# Altium schematic sheet MCU.SchDoc: LUNA_MCU
size A; Date: 13.07.2025; Author: Mert Ali Cakici; Revision: 0.1; SheetNumber: 1; SheetTotal: 3
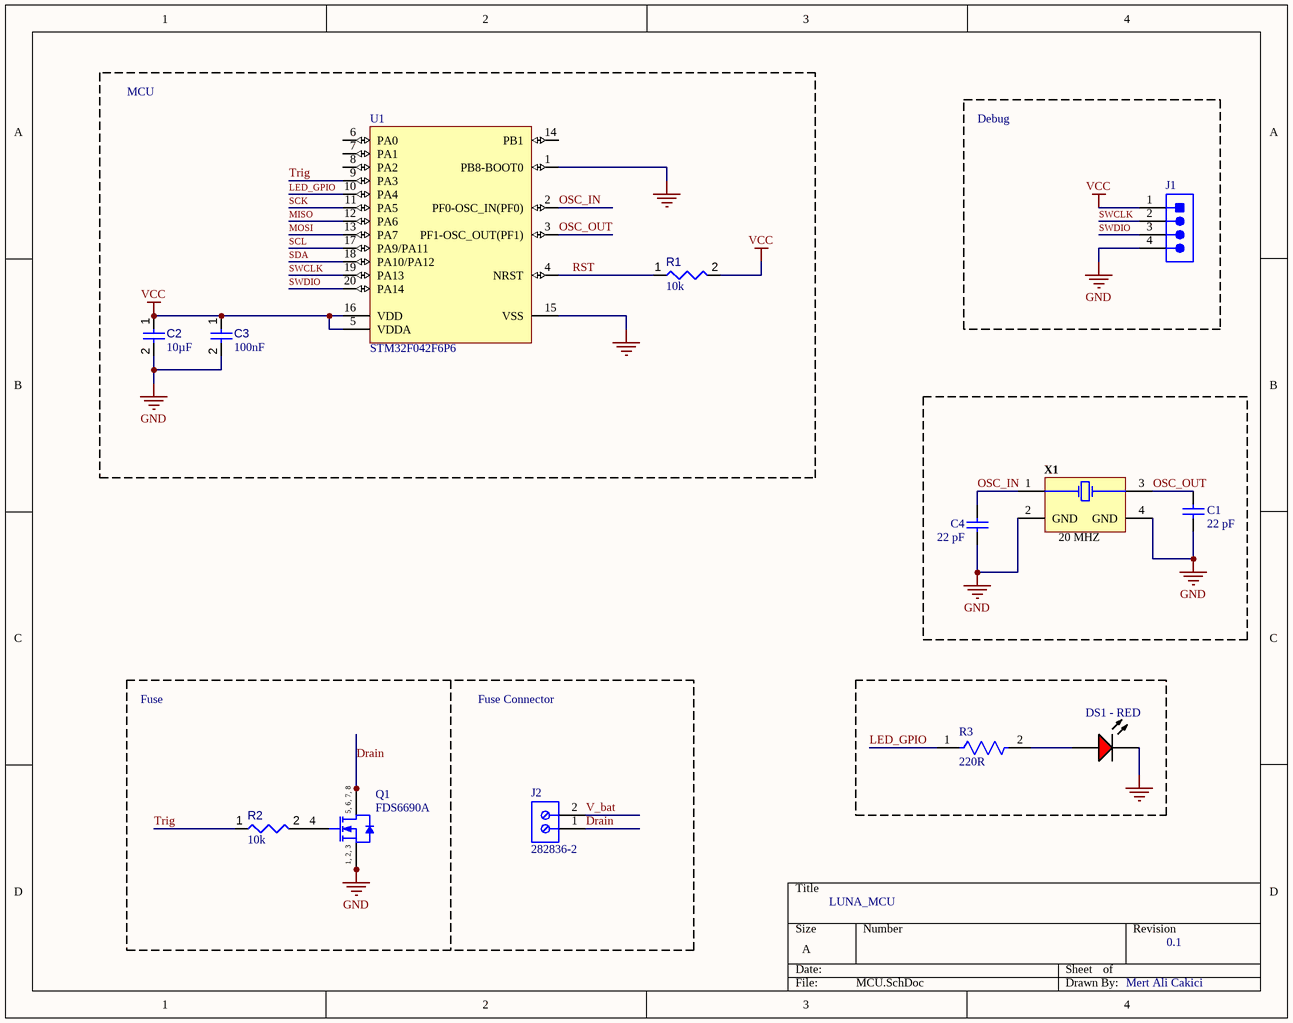
[diagram p0: MCU.SchDoc]

## Parts
C1  22 pF  [CAPC1608X90X35NL10T15]
C2  value 10µF  [CAPC0603(1608)100_L]  (hidden comment: Capacitor 10µF +/-20% 10V 0603)
C3  value 100nF  [CAPC1608X90X40NL10T20]  (hidden comment: Capacitor 100 nF +/-10% 50 V 0603)
C4  22 pF  [CAPC1608X90X35NL10T15]
DS1_-_RED  19-217/R6C-AL1M2VY/3T  [EVRL-0603-2_V]  (value not drawn)
J1  640456-4  [TECO-640456-4]  (value not drawn)
J2  282836-2  [TECO-282836-2_V]
Q1  FDS6690A  [FAIR-SOIC-8_V]
R1  value 10k  [RESC1608X55X25NL10T15]  (hidden comment: Resistor 10k +/-1% 0603 100 mW)
R2  value 10k  [RESC1608X55X25NL10T15]  (hidden comment: Resistor 10k +/-1% 0603 100 mW)
R3  220R  [FP-CRCW0603-e3-MFG]
U1  STM32F042F6P6  [STM-TSSOP20_M]
X1  20 MHZ  [TXC-7B-4_V]

## Blocks framed on the sheet
MCU: C2 C3 R1 U1
Debug: J1

## Nets
GND: C1.1 C2.2 C3.2 C4.1 DS1_-_RED.2(K) J1.4 Q1.1(S) Q1.2(S) Q1.3(S) U1.1(PB8-BOOT0) U1.15(VSS) X1.2(GND) X1.4(GND)
VCC: C2.1 C3.1 J1.1 R1.2 U1.5(VDDA) U1.16(VDD)
Drain: J2.1 Q1.5(D) Q1.6(D) Q1.7(D) Q1.8(D)
LED_GPIO: R3.1 U1.10(PA4)
MISO: U1.12(PA6)
MOSI: U1.13(PA7)
OSC_IN: C4.2 U1.2(PF0-OSC_IN(PF0)) X1.1(X1)
OSC_OUT: C1.2 U1.3(PF1-OSC_OUT(PF1)) X1.3(X2)
RST: R1.1 U1.4(NRST)
SCK: U1.11(PA5)
SCL: U1.17(PA9/PA11)
SDA: U1.18(PA10/PA12)
SWCLK: J1.2 U1.19(PA13)
SWDIO: J1.3 U1.20(PA14)
Trig: R2.1 U1.9(PA3)
V_bat: J2.2
NetDS1_-_RED_1: DS1_-_RED.1(A) R3.2
NetQ1_4: Q1.4(G) R2.2

Not connected (* = marked no-connect by the designer): U1 6(PA0) 7(PA1) 8(PA2) 14(PB1)

## Notes on the sheet
- Fuse
- Fuse Connector
- (in symbol CMP-2000-06260-1) 5, 6, 7, 8; 1, 2, 3

## Library data of the parts
C1 C4 = CMP-2000-04945-1: Chip Capacitor, 22 pF, +/- 5%, 50 V, -55 to 125 degC, 0603 (1608 Metric), RoHS, Tape and Reel; Manufacturer: Murata; Capacitance: 22pF; Rated Voltage: 50V; Dielectric: C0G; Manufacturer URL: http://www.murata.com/; Datasheet Version: Jul-06; Package Reference: 603; Tolerance (%): ±5%; Case Size/Dimension: 0603; Package Description: 2-Pin Surface Mount Device, Body 1.6 x 0.8 mm; Datasheet URL: https://datasheet.ciiva.com/11786/0900766b807a1cab-11786398.pdf
C2 = CMP-001-00075-4: Chip Capacitor, 10µF +/-20%, 10V, 0603, Thickness 1 mm; Tolerance: 10%; Voltage Rating: 10V; Max Operating Temperature: 85°C; Pins: 2; Case/Package: 0603; Mounting Technology: SMT; Min Operating Temperature: -55°C
C3 = CMP-001-00017-6: Chip Capacitor, 100 nF, +/- 10%, 50 V, 0603 (1608 Metric); Voltage Rating: 50V; Capacitor Type: Ceramic; Tolerance: 10%; Mounting Technology: SM; Max Operating Temperature: 125°C; RoHS Compliant: True; Pins: 2; Case/Package: 0603; Min Operating Temperature: -55°C
DS1_-_RED = CMP-007-00004-2: Chip LED, Red, 5 V, 25 mA, -40 to 85 degC, 2-Pin SMD (0603), RoHS, Tape and Reel; Manufacturer: Everlight Electronics; Forward Voltage: 2.2V; Lens Style: Clear; Package Reference: 0603; Datasheet Version: Rev. 1, 01/2005; Mounting Technology: SM; RoHS Compliant: False; Datasheet URL: https://datasheet.ciiva.com/4688/el-19-217-r6c-al1m2vy-3tpdf-187026-4688713.pdf; Case/Package: 0603; Colour: Red; Manufacturer URL: http://www.everlight.com/; Package Description: 2-Pin Surface Mount Device, Body 1.6 x 0.8 mm
J1 = CMP-2000-05419-1: Male Header, Pitch 2.54 mm, 1 x 4 Position, Height 10.03 mm, Tail Length 3.56 mm, RoHS, Bulk; Manufacturer: TE Connectivity; Material, Housing: Polyester; Primary Type: InterconnectSystem; Mount Angle: Vertical; Color, Housing: White; Current, Rating: 5 / A; Agency Approvals: CSA,UL; Contact Termination Area Plating: Tin; Temperature, Operating: -55to+105 / degC; Standards: RoHSCompliant,ELVCompliant,UL94V-0; Number of Positions: 4; Brand/Series: MTA-100Series; Angle: Straight; Pin Spacing: 0.1 / "; Material, Contact: CopperAlloy; Connector Type: MTA-100; Special Features: Pinstrip; Mounting Hole Size: 0.04 / "; Contact Centerline Spacing: 0.100 / in.; Voltage, Rating: 250 / V; Manufacturer URL: http://www.te.com/; Length, Pin: 0.14 / "; Length, Overall: 0.4 / "; Color: White; Flammability Rating: UL94V-0; Mounting Type: PCMount; Termination: Solder; Datasheet URL: https://datasheet.ciiva.com/16286/eng-ds-82056-mta-0608-16286228.pdf; Number of Contacts: 4; Contact Shape: Square; Contact Mating Area Plating: Tin; Length, Terminal Post: 0.14 / in.; Size, Post: 0.025 / in.; Contact Plating: Tin; Type: PCBPlug; Datasheet Version: Dec-14; Number of Rows: 1
J2 = CMP-1684-00017-1: Female Header, Pitch 5 mm, 1 x 2 Position, Height 10 mm, Tail Length 3.5 mm, Rohs, Bulk; Manufacturer: TE Connectivity; Wire Gauge: 16-30AWG; Product Training Modules: Wire-to-BoardEurostyleTerminalBlocks; Clamp Material - Plating: Brass-NickelPlated; Voltage: 300V; Mating Orientation: HorizontalwithBoard; Current: 13.5A; Pitch: 0.197"(5.00mm); Screw Thread: M3; 3D Model: 282836-2.pdf; Other Names: 5ULV-02B / A98076; Dynamic Catalog: BuchananSeries; Number of Levels: 1; Torque - Screw: 0.68Nm(6Lb-In); Featured Product: EurostyleTerminalBlockConnectors; Positions Per Level: 2; Wire Termination: Screw-RisingCageClamp; Datasheet URL: http://www.te.com.cn/commerce/DocumentDelivery/DDEController?Action=showdoc&DocId=Catalog+Section%7F1308389_EUROSTYLE_TERMINAL_BLOCKS%7F0607%7Fpdf%7FEnglish%7FENG_CS_1308389_EUROSTYLE_TERMINAL_BLOCKS_0607.pdf%7F282836-2; Color: Green; Family: TerminalBlocks-WiretoBoard; RoHS Information: 282836-2StatementofCompliance; Standard Package: 300; Contact Material - Plating: Brass-TinPlated; Manufacturer URL: http://www.te.com; Housing Material: Polyamide(PA66),Nylon6/6; Features: Interlocking(Side); Package Description: Female Header, Pitch 5 mm, 1 x 2 Position, Height 10 mm, Tail Length 3.5 mm; Mounting Type: ThroughHole; Package Reference: THD; Packaging: Bulk; Series: Buchanan; Category: Connectors,Interconnects; Screw Material - Plating: Brass-NickelPlated
Q1 = CMP-2000-06260-1: Single N-Channel, Logic-Level, PowerTrench(R) MOSFET, 11 A, 30 V, -55 to 150 degC, 8-Pin SOIC (SO-8), RoHS, Tape and Reel; Manufacturer: Fairchild Semiconductor; Typical Turn-Off Delay Time: 28ns; Transistor Material: Si; Typical Turn-On Delay Time: 9ns; Channel Mode: Enhancement; Maximum Power Dissipation: 2.5W; Typical Input Capacitance @ Vds: 1205pF@15V; Maximum Continuous Drain Current: 11A; Maximum Gate Source Voltage: ±20V; Channel Type: N; Typical Gate Charge @ Vgs: 12nC@5V; Number of Elements per Chip: 1; Minimum Gate Threshold Voltage: 1V; Maximum Drain Source Resistance: 0.013Ω; Maximum Drain Source Voltage: 30V; Datasheet Version: Rev. E1, 02/2007; Length: 5mm; Category: PowerMOSFET; Mounting Type: SurfaceMount; Pin Count: 8; Minimum Operating Temperature: -55°C; Dimensions: 5x4x1.5mm; Package Type: SOIC; Width: 4mm; Datasheet URL: https://www.fairchildsemi.com/datasheets/FD/FDS6690A.pdf; Manufacturer URL: https://www.fairchildsemi.com/; Package URL: https://www.fairchildsemi.com/package-drawings/M0/M08A.pdf; Mounting Technology: SurfaceMount; Package Reference: SOIC-8; Maximum Operating Temperature: +150°C; Package Description: 8-Pin Small Outline Integrated Circuit, Body 4.9 x 3.9 mm, Pitch 1.27 mm; Transistor Configuration: Single; Height: 1.5mm
R1 R2 = CMP-009-00017-5: Chip Resistor, 10 KOhm, +/- 1%, 01 W, -55 to 155 degC, 0603 (1608 Metric); Voltage Rating: 50V; Power: 100mW; RoHS Compliant: True; Min Operating Temperature: -55°C; Pins: 2; Case/Package: 0603; Mounting Technology: SM; Max Operating Temperature: 155°C; Tolerance: 1%
R3 = CMP-2000-03085-2: RES Thick Film, 220Ω, 1%, 0.1W, 100ppm/°C, 0603; Power Rating: 100mW; Voltage Rating: 75V; Contact Plating: Tin; Package Quantity: 10; Lead Free: Lead Free; Packaging: Tape and Reel; Max Operating Temperature: 155°C; Case/Package: 0603; Radiation Hardening: No; Height: 0.45mm; Width: 0.033inch; Case Code (Imperial): 0603; Number of Terminations: 2; Tolerance: 1%; Min Operating Temperature: -55°C; Termination: SMD/SMT; Length: 1.55mm; Features: Automotive AEC-Q200; Voltage Rating (DC): 75V; Case Code (Metric): 1608; Composition: Thick Film; Resistance: 220R; Military Standard: Not; Temperature Coefficient: 100ppm/°C; Depth: 0.85mm; Weight: 7.1E-05oz; Max Power Dissipation: 100mW
U1 = CMP-0304-00108-2: ARM Cortex-M0 32-bit MCU, 32 KB Flash, 6 KB Internal RAM, 16 I/Os, 20-Pin TSSOP, -40 to 85 degC, Tube; Manufacturer: STMicroelectronics; Package Description: 20-Pin Thin Shrink Small Outline Package, Body 6.5 x 4.4 mm, Pitch 0.65 mm; ComponentLink1URL: http://www.st.com/; ComponentLink2Description: Datasheet; Package Reference: TSSOP20; ComponentLink2URL: http://www.st.com/st-web-ui/static/active/en/resource/technical/document/datasheet/DM00105814.pdf; ComponentLink1Description: Manufacturer URL; Mounting Technology: Surface Mount; Core: ARM Cortex-M0; PartNumber: STM32F042F6P6; DatasheetVersion: Rev. 5
X1 = CMP-003-00011-2: SMD Seam Sealing Crystal, 24 MHz, +/- 30 ppm, 18 pF, -10 to 70 degC, 4-Pin SMD, RoHS, Tape and Reel; Manufacturer: TXC; Resistance: 40Ohm; Frequency: 24MHz; Tolerance: 30ppm; ESR: 40; Load Capacitance: 18pF; Package Description: 4-Pin Surface Mount Device, Body 5 x 3.2 mm, Pitch 3.7 mm; Pins: 4; Mounting Technology: SM; Package Reference: 7B-4; Max Operating Temperature: 70°C; Package Quantity: 1000; Min Operating Temperature: -20°C; Datasheet URL: http://www.txccorp.com/download/products/quartz_crystals/2015TXC_7B_19.pdf; RoHS Compliant: True; Datasheet Version: Jul-15; Case/Package: 7B-4; Packaging: TapeandReel; Frequency Tolerance: 30ppm